# Altium schematic sheet OFFLINE_POWER_LNK30X.SchDoc
size A4; SheetNumber: 4; SheetTotal: 4
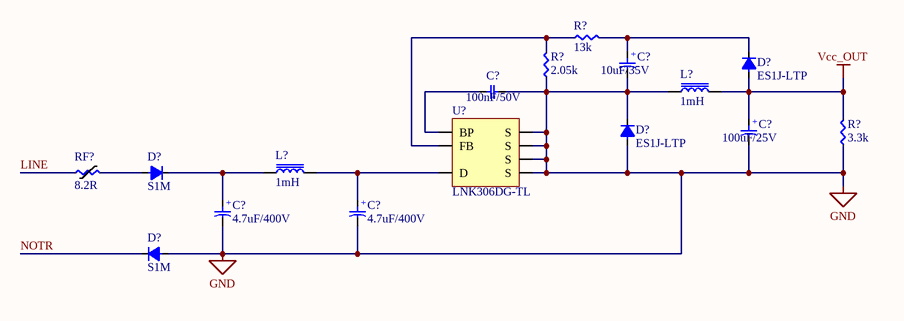
[diagram p0: OFFLINE_POWER_LNK30X.SchDoc]

## Parts
(Parts that share a designator on the sheet are numbered #1, #2 ... from top to bottom, then left to right.)
C?#1  10uF/35V  [Cap_Alu_1.5x4x8mm]
C?#2  100nF/50V  [Cap_0805]
C?#3  100uF/25V  [Cap_Alu_6.3x11x2.5mm]
C?#4  4.7uF/400V  [Cap_Alu_5x10x14.5mm]
C?#5  4.7uF/400V  [Cap_Alu_5x10x14.5mm]
D?#1  ES1J-LTP  [DO214AC(SMA)]
D?#2  ES1J-LTP  [DO214AC(SMA)]
D?#3  S1M  [DO214AC(SMA)]
D?#4  S1M  [DO214AC(SMA)]
L?#1  1mH  [INDUCTOR_7.8x7.0x5]
L?#2  1mH  [INDUCTOR_7.8x7.0x5]
R?#1  13k  [R_0805]
R?#2  2.05k  [R_0805]
R?#3  3.3k  [R_0805]
RF?  8.2R  [R_DIP_(6x12)_PIN_0.65]
U?  LNK306DG-TL  [SO8C-NOPIN3]

## Nets
GND: C?#1.2 C?#2.2 C?#3.2 C?#4.2 C?#5.2 D?#2.A(Anot) D?#2.K(Katot) D?#4.A(Anot) L?#1.1 R?#2.1 R?#3.1 U?.5(S) U?.6(S) U?.7(S) U?.8(S)
Vcc_OUT: C?#3.1 D?#1.A(Anot) L?#1.2 R?#3.2
LINE: RF?.1
NOTR: D?#4.K(Katot)
NetC?#1_1: C?#1.1 D?#1.K(Katot) R?#1.2
NetC?#2_1: C?#2.1 U?.1(BP)
NetC?#4_1: C?#4.1 D?#3.K(Katot) L?#2.1
NetC?#5_1: C?#5.1 L?#2.2 U?.4(D)
NetD?#3_A: D?#3.A(Anot) RF?.2
NetR?#1_1: R?#1.1 R?#2.2 U?.2(FB)

## Notes on the sheet
- (in symbol 400LLE4R7MEFC10X12.5) +
- (in symbol ECA-1EM101I) +
- (in symbol USR1V100MDD1TE) +

## Library data of the parts
C?#1 = USR1V100MDD1TE: CAP ALUM uF 10 35V 20% RADIAL; Manufacturer: Nichicon; Capacitance: 10uF; Polarity: Polar; Ripple Current: 31mA; Life (Hours): 2000Hour; Supplier 1: Digi-Key; Manufacturer Part Number: USR1V100MDD1TE; Stock 1: 4749; Pricing 1: 1 = 0,25000, 10 = 0,17200, 50 = 0,10300, 100 = 0,08700, 500 = 0,05954, 1000 = 0,05267 (USD); Mount: Through Hole; Case/Package: Radial; Min Operating Temperature: -40°C; Max Operating Temperature: 85°C; Package Quantity: 4000; Packaging: Tape and Reel; Voltage Rating: 35V; Tolerance: 20%; Lead Pitch: 0.059inch; Height - Seated (Max): 0.315inch; ComponentLink1URL: http://nichicon-us.com/english/products/pdfs/e-usa_usr.pdf?src-supplier=Digi-Key; ComponentLink1Description: http://nichicon-us.com/english/products/pdfs/e-usa_usr.pdf?src-supplier=Digi-Key; Supplier Part Number 1: 493-17431-1-ND
C?#2 = C2012X7R1H104K125AE: CAP CER nF 100 50V X7R 0805; Manufacturer: TDK Corporation; Tolerance: ±10%; Supplier 1: Digi-Key; Manufacturer Part Number: C2012X7R1H104K125AE; RoHS: RoHS Compliant; Category: Capacitors; Stock 1: 21863; Pricing 1: 1=0.29, 10=0.197, 100=0.1118, 500=0.07894, 1000=0.06907 (USD); Packaging: Cut Tape (CT); Part Status: Active; Voltage - Rated: 50V; Temperature Coefficient: X7R; Operating Temperature: -55°C ~ 125°C; Features: Soft Termination; Ratings: -; Applications: Boardflex Sensitive; Failure Rate: -; Mounting Type: Surface Mount, MLCC; Package / Case: 0805 (2012 Metric); Size / Dimension: 0.079" L x 0.049" W (2.00mm x 1.25mm); Height - Seated (Max): -; Thickness (Max): 0.057" (1.45mm); Lead Spacing: -; Lead Style: -; ComponentLink1URL: https://product.tdk.com/info/en/catalog/datasheets/mlcc_commercial_soft_en.pdf; ComponentLink1Description: https://product.tdk.com/info/en/catalog/datasheets/mlcc_commercial_soft_en.pdf; Supplier Part Number 1: 445-15929-1-ND
C?#3 = ECA-1EM101I: CAP ALUM uF 100 25V 20% RADIAL; Manufacturer 1: Panasonic; Description 1: Cap Aluminum Lytic 100uF 25V 20% (6.3 X 11.2mm) Radial 2.5mm 180mA 2000h 85C Ammo Pack; Capacitance: 100uF; Ripple Current: 180mA; Polarity: Polar; Life (Hours): 2000Hour; Leakage Current: 3mA; Dissipation Factor: 0.16%; Lead/Base Style: Straight; Lead Diameter: 0.5mm; Supplier 1: Digi-Key; Manufacturer Part Number 1: ECA-1EM101I; Stock 1: 18000; Pricing 1: 2000=0.0534, 4000=0.0494, 10000=0.04673, 14000=0.04432, 50000=0.04005, 100000=0.03631 (USD); Mount: Through Hole,PCB; Case/Package: Radial; Contact Plating: Tin; Min Operating Temperature: -40°C; Max Operating Temperature: 85°C; Tolerance: 20%; Voltage Rating (DC): 25V; Voltage Rating: 25V; Packaging: Tape and Reel; Package Quantity: 2000; Termination: Radial; Voltage: 25V; Diameter: 6.3mm; Length: 11.2mm; Height: 11.2mm; Lead Pitch: 2.5mm; Height - Seated (Max): 0.48inch; Radiation Hardening: No; REACH SVHC: Unknown; Lead Free: Lead Free; ComponentLink1URL: http://industrial.panasonic.com/www-data/pdf/ABA0000/ABA0000CE12.pdf?src-supplier=Avnet; ComponentLink1Description: http://industrial.panasonic.com/www-data/pdf/ABA0000/ABA0000CE12.pdf?src-supplier=Avnet; ComponentLink2URL: https://www.verical.com/server-webapp/html/getDatasheet?partID=239702&src-supplier=Verical; ComponentLink2Description: https://www.verical.com/server-webapp/html/getDatasheet?partID=239702&src-supplier=Verical; ComponentLink3URL: http://www.farnell.com/datasheets/1907780.pdf?src-supplier=Element14; ComponentLink3Description: http://www.farnell.com/datasheets/1907780.pdf?src-supplier=Element14; ComponentLink4URL: http://www.onlinecomponents.com/productFiles/mf-PSC/aba0000ce12.pdf?src-supplier=Onlinecomponents.com; ComponentLink4Description: http://www.onlinecomponents.com/productFiles/mf-PSC/aba0000ce12.pdf?src-supplier=Onlinecomponents.com; ComponentLink5URL: http://www.mouser.com/ds/2/315/ABA0000CE12-465472.pdf?src-supplier=Mouser; ComponentLink5Description: http://www.mouser.com/ds/2/315/ABA0000CE12-465472.pdf?src-supplier=Mouser; Supplier Part Number 1: P10413TB-ND
C?#4 C?#5 = 400LLE4R7MEFC10X12.5: CAP ALUM uF 4.7 400V 20% RADIAL; Manufacturer: Rubycon; Capacitance: 4.7uF; Ripple Current: 61mA; Life (Hours): 15000Hour; Supplier 1: Digi-Key; Manufacturer Part Number: 400LLE4R7MEFC10X12.5; Stock 1: 36795; Pricing 1: 1 = 0,59000, 10 = 0,41400, 50 = 0,31280, 100 = 0,27240, 500 = 0,20180, 1000 = 0,17153, 2500 = 0,16144, 5000 = 0,15135 (USD); RoHS: Yes; Mount: Through Hole; Case/Package: Radial; Min Operating Temperature: -40°C; Max Operating Temperature: 105°C; Tolerance: 20%; Package Quantity: 1000; Voltage Rating: 400V; Packaging: Bulk; Termination: Radial; Voltage Rating (DC): 400V; Diameter: 10mm; Height: 12.5mm; Lead Pitch: 0.197inch; Height - Seated (Max): 0.571inch; Radiation Hardening: No; ComponentLink1URL: https://datasheet.ciiva.com/6327/e-lle-6327238.pdf?src-supplier=Digi-Key; ComponentLink1Description: https://datasheet.ciiva.com/6327/e-lle-6327238.pdf?src-supplier=Digi-Key; Supplier Part Number 1: 1189-1334-ND
D?#1 D?#2 = ES1J-LTP: DIODE GEN PURP 600V 1A DO214AC; Manufacturer: MCC; Forward Voltage: 1.7V; Max Surge Current: 30A; Reverse Recovery Time: 35ns; Element Configuration: Single; Max Reverse Current: 80uA; Supplier 1: Digi-Key; Manufacturer Part Number: ES1J-LTP; RoHS: Yes; Category: Rectifier Diodes; Stock 1: 109029; Pricing 1: 1=0,45000, 10=0,33400, 100=0,18940, 500=0,12540, 1000=0,09614, 2000=0,08360 (USD); Mount: Surface Mount; Case/Package: SMA; Number of Pins: 2; Weight: 0.001199oz; Min Operating Temperature: -65°C; Max Operating Temperature: 175°C; Packaging: Tape and Reel; Package Quantity: 1; Reverse Voltage (DC): 600V; Average Rectified Current: 1A; Peak Non-Repetitive Surge Current: 30A; Forward Current: 1A; Recovery Time: 35ns; Max Reverse Voltage (DC): 600V; Series: -; Radiation Hardening: No; Lead Free: Lead Free; RoHS Compliant: Yes; ComponentLink1URL: https://datasheet.ciiva.com/917/es1a-les1j-ldo-214ac-917284.pdf?src-supplier=Digi-Key; ComponentLink1Description: https://datasheet.ciiva.com/917/es1a-les1j-ldo-214ac-917284.pdf?src-supplier=Digi-Key; ComponentLink2URL: https://datasheet.ciiva.com/917/es1a-les1j-ldo-214ac-917285.pdf?src-supplier=Digi-Key; ComponentLink2Description: https://datasheet.ciiva.com/917/es1a-les1j-ldo-214ac-917285.pdf?src-supplier=Digi-Key; ComponentLink3URL: https://datasheet.ciiva.com/917/es1a-les1j-ldo-214ac-917283.pdf?src-supplier=Digi-Key; ComponentLink3Description: https://datasheet.ciiva.com/917/es1a-les1j-ldo-214ac-917283.pdf?src-supplier=Digi-Key; Supplier Part Number 1: ES1J-LTPMSCT-ND
D?#3 D?#4 = S1M: DIODE GEN PURP 1KV 1A SMA; Manufacturer 1: ON Semiconductor / Fairchild; Forward Voltage: 1.1V; Element Configuration: Single; Reverse Recovery Time: 1.8us; Peak Non-Repetitive Surge Current: 30A; Polarity: Standard; Capacitance: 12pF; Peak Reverse Current: 1uA; Power Dissipation: 1.4W; Max Surge Current: 40A; Recovery Time: 1800ns; Supplier 1: Digi-Key; Manufacturer Part Number 1: S1M; Stock 1: 186500; Pricing 1: 1=0,24000, 10=0,19800, 25=0,16560, 100=0,08100, 250=0,07968, 500=0,06752, 1000=0,04692, 2500=0,04361 (USD); RoHS: Yes; Mount: Surface Mount; Case/Package: SMA; Number of Pins: 2; Contact Plating: Tin,Matte; Min Operating Temperature: -55°C; Max Operating Temperature: 150°C; Max Repetitive Reverse Voltage (Vrrm): 1kV; Max Forward Surge Current (Ifsm): 30A; Voltage Rating (DC): 1kV; Current Rating: 1A; Output Current: 1A; Packaging: Tape and Reel; Forward Current: 1A; Current: 1A; Voltage: 1kV; Max Reverse Voltage (DC): 1kV; Reverse Voltage: 1kV; Average Rectified Current: 1A; Package Quantity: 1; Termination: SMD/SMT; Length: 4.75mm; Height: 2.2mm; Width: 5.28mm; Radiation Hardening: No; REACH SVHC: No SVHC; Lead Free: Lead Free; ComponentLink1URL: https://datasheet.ciiva.com/27051/1072719-27051364.pdf?src-supplier=Jameco; ComponentLink1Description: https://datasheet.ciiva.com/27051/1072719-27051364.pdf?src-supplier=Jameco; ComponentLink2URL: https://datasheet.ciiva.com/4452/s1m-191340-4452980.pdf?src-supplier=Mouser; ComponentLink2Description: https://datasheet.ciiva.com/4452/s1m-191340-4452980.pdf?src-supplier=Mouser; ComponentLink3URL: https://datasheet.ciiva.com/910/s1a-910496.pdf?src-supplier=Digi-Key; ComponentLink3Description: https://datasheet.ciiva.com/910/s1a-910496.pdf?src-supplier=Digi-Key; ComponentLink4URL: https://datasheet.ciiva.com/8303/s1k-8303577.pdf?src-supplier=Avnet; ComponentLink4Description: https://datasheet.ciiva.com/8303/s1k-8303577.pdf?src-supplier=Avnet; ComponentLink5URL: https://datasheet.ciiva.com/7965/96437-7965306.pdf?src-supplier=Element14; ComponentLink5Description: https://datasheet.ciiva.com/7965/96437-7965306.pdf?src-supplier=Element14; ComponentLink6URL: https://datasheet.ciiva.com/5739/1766308-5739339.pdf?src-supplier=Farnell; ComponentLink6Description: https://datasheet.ciiva.com/5739/1766308-5739339.pdf?src-supplier=Farnell; ComponentLink7URL: https://datasheet.ciiva.com/7965/1766308-7965189.pdf?src-supplier=Element14; ComponentLink7Description: https://datasheet.ciiva.com/7965/1766308-7965189.pdf?src-supplier=Element14; ComponentLink8URL: https://datasheet.ciiva.com/22651/1766308-22651974.pdf?src-supplier=Element14; ComponentLink8Description: https://datasheet.ciiva.com/22651/1766308-22651974.pdf?src-supplier=Element14; ComponentLink9URL: https://datasheet.ciiva.com/7965/1766308-7965307.pdf?src-supplier=Element14; ComponentLink9Description: https://datasheet.ciiva.com/7965/1766308-7965307.pdf?src-supplier=Element14; Supplier Part Number 1: S1MFSCT-ND
L?#1 L?#2 = 76877530: FIXED IND mH 1 300MA 3.3 OHM SMD; Manufacturer: Wurth Electronics; Core Material: Ferrite; Tolerance: 10%; Shielding: Unshielded; DC Resistance (DCR): 3.3R; Self Resonant Frequency: 2.4MHz; Test Frequency: 100kHz; Supplier 1: Digi-Key; Manufacturer Part Number: 76877530; Stock 1: 1085; Pricing 1: 1 = 2,22000, 10 = 2,04600, 50 = 1,83500, 100 = 1,76400, 250 = 1,69300 (USD); RoHS: Yes; Mount: Surface Mount; Case/Package: 7850; Min Operating Temperature: -40°C; Max Operating Temperature: 125°C; Saturation Current: 300mA; Packaging: Cut Tape; Package Quantity: 500; Current Rating: 300mA; Inductance Tolerance: 10%; Resistor Type: Wirewound; Inductance: 1mH; Max DC Current: 300mA; Termination: SMD/SMT; RMS Current (Irms): 300mA; Length: 0.307inch; Width: 0.276inch; Height: 5mm; Height - Seated (Max): 0.217inch; REACH SVHC: Unknown; ComponentLink1URL: https://datasheet.ciiva.com/6690/76877530-6690354.pdf?src-supplier=Digi-Key; ComponentLink1Description: https://datasheet.ciiva.com/6690/76877530-6690354.pdf?src-supplier=Digi-Key; ComponentLink2URL: https://datasheet.ciiva.com/13320/76877530-64988-13320676.pdf?src-supplier=Mouser; ComponentLink2Description: https://datasheet.ciiva.com/13320/76877530-64988-13320676.pdf?src-supplier=Mouser; ComponentLink3URL: https://datasheet.ciiva.com/7892/1736809-7892998.pdf?src-supplier=Element14; ComponentLink3Description: https://datasheet.ciiva.com/7892/1736809-7892998.pdf?src-supplier=Element14; ComponentLink4URL: https://datasheet.ciiva.com/7265/1243443-7265530.pdf?src-supplier=Newark; ComponentLink4Description: https://datasheet.ciiva.com/7265/1243443-7265530.pdf?src-supplier=Newark; ComponentLink5URL: https://datasheet.ciiva.com/6690/76877530-6690358.pdf?src-supplier=Digi-Key; ComponentLink5Description: https://datasheet.ciiva.com/6690/76877530-6690358.pdf?src-supplier=Digi-Key; Supplier Part Number 1: 732-3272-6-ND
R?#1 = RC0805FR-0713KL: RES SMD 13K OHM 1% 1/8W 0805; Manufacturer: Yageo; Resistance: 13kR; Temperature Coefficient: 100ppm/°C; Voltage Rating (DC): 150V; Power Rating: 125mW; Supplier 1: Digi-Key; Manufacturer Part Number: RC0805FR-0713KL; Stock 1: 172528; Pricing 1: 1 = 0,10000, 10 = 0,03600, 100 = 0,01470, 1000 = 0,00660, 2500 = 0,00573 (USD); RoHS: Yes; Mount: Surface Mount; Case/Package: 0805; Case Code (Metric): 2012; Case Code (Imperial): 0805; Min Operating Temperature: -55°C; Max Operating Temperature: 155°C; Tolerance: 1%; Packaging: Tape and Reel; Resistor Type: Thick Film; Voltage Rating: 150V; Termination: SMD/SMT; Package Quantity: 1; Number of Terminations: 2; Max Power Dissipation: 125mW; Features: Moisture Resistant; Length: 2mm; Width: 0.049inch; Height: 0.5mm; Depth: 1.25mm; Lead Free: Lead Free; Military Standard: Not; ComponentLink1URL: https://datasheet.ciiva.com/11808/0900766b8106beab-11808595.pdf?src-supplier=RSComponents; ComponentLink1Description: https://datasheet.ciiva.com/11808/0900766b8106beab-11808595.pdf?src-supplier=RSComponents; ComponentLink2URL: https://datasheet.ciiva.com/2457/pyu-r-int-thick-7-2457158.pdf?src-supplier=Digi-Key; ComponentLink2Description: https://datasheet.ciiva.com/2457/pyu-r-int-thick-7-2457158.pdf?src-supplier=Digi-Key; ComponentLink3URL: https://datasheet.ciiva.com/2457/pyu-r-int-thick-7-2457159.pdf?src-supplier=Digi-Key; ComponentLink3Description: https://datasheet.ciiva.com/2457/pyu-r-int-thick-7-2457159.pdf?src-supplier=Digi-Key; ComponentLink4URL: https://datasheet.ciiva.com/2457/pyu-r-int-thick-7-2457160.pdf?src-supplier=Digi-Key; ComponentLink4Description: https://datasheet.ciiva.com/2457/pyu-r-int-thick-7-2457160.pdf?src-supplier=Digi-Key; ComponentLink5URL: https://datasheet.ciiva.com/16746/rc0805-16746411.pdf?src-supplier=Future+Electronics; ComponentLink5Description: https://datasheet.ciiva.com/16746/rc0805-16746411.pdf?src-supplier=Future+Electronics; ComponentLink6URL: https://datasheet.ciiva.com/15189/getdatasheetpartid-329342-15189900.pdf?src-supplier=Verical; ComponentLink6Description: https://datasheet.ciiva.com/15189/getdatasheetpartid-329342-15189900.pdf?src-supplier=Verical; Supplier Part Number 1: 311-13.0KCRDKR-ND
R?#2 = RC0805FR-072K05L: RES SMD 2.05K OHM 1% 1/8W 0805; Manufacturer: Yageo; Resistance: 2.05kR; Power Rating: 125mW; Voltage Rating: 150V; Temperature Coefficient: 100ppm/°C; Supplier 1: Avnet; Manufacturer Part Number: RC0805FR-072K05L; Stock 1: 0; Pricing 1: 5000 = 0,00230, 10000 = 0,00227, 20000 = 0,00220, 30000 = 0,00216, 40000 = 0,00207 (USD); RoHS: Yes; Case/Package: 0805; Case Code (Metric): 2012; Case Code (Imperial): 0805; Contact Plating: Tin,Matte,Lead; Min Operating Temperature: -55°C; Max Operating Temperature: 155°C; Package Quantity: 1; Tolerance: 1%; Packaging: Tape and Reel; Resistor Type: Thick Film; Number of Terminations: 2; Termination: SMD/SMT; Max Power Dissipation: 125mW; Voltage Rating (DC): 150V; Features: Moisture Resistant; Length: 2mm; Width: 0.049inch; Height: 0.024inch; Depth: 1.25mm; Radiation Hardening: No; Lead Free: Lead Free; Military Standard: Not; ComponentLink1URL: https://datasheet.ciiva.com/2457/pyu-r-int-thick-7-2457696.pdf?src-supplier=Digi-Key; ComponentLink1Description: https://datasheet.ciiva.com/2457/pyu-r-int-thick-7-2457696.pdf?src-supplier=Digi-Key; ComponentLink2URL: https://datasheet.ciiva.com/2457/pyu-r-int-thick-7-2457697.pdf?src-supplier=Digi-Key; ComponentLink2Description: https://datasheet.ciiva.com/2457/pyu-r-int-thick-7-2457697.pdf?src-supplier=Digi-Key; ComponentLink3URL: https://datasheet.ciiva.com/16747/rc0805-16747269.pdf?src-supplier=Future+Electronics; ComponentLink3Description: https://datasheet.ciiva.com/16747/rc0805-16747269.pdf?src-supplier=Future+Electronics; ComponentLink4URL: https://datasheet.ciiva.com/12558/rc0805-257173-12558759.pdf?src-supplier=Mouser; ComponentLink4Description: https://datasheet.ciiva.com/12558/rc0805-257173-12558759.pdf?src-supplier=Mouser; ComponentLink5URL: https://datasheet.ciiva.com/2457/pyu-r-int-thick-7-2457695.pdf?src-supplier=Digi-Key; ComponentLink5Description: https://datasheet.ciiva.com/2457/pyu-r-int-thick-7-2457695.pdf?src-supplier=Digi-Key; Supplier Part Number 1: RC0805FR-072K05L
R?#3 = RC0805JR-073K3L: RES SMD 3.3K OHM 5% 1/8W 0805; Manufacturer: Yageo; Resistance: 3.3kR; Power Rating: 125mW; Voltage Rating: 150V; Temperature Coefficient: 100ppm/°C; Supplier 1: Digi-Key; Manufacturer Part Number: RC0805JR-073K3L; Stock 1: 223645; Pricing 1: 1 = 0,10000, 10 = 0,03100, 100 = 0,01260, 1000 = 0,00567, 2500 = 0,00492 (USD); RoHS: Yes; Case/Package: 0805; Case Code (Imperial): 0805; Case Code (Metric): 2012; Contact Plating: Tin,Matte,Lead; Min Operating Temperature: -55°C; Max Operating Temperature: 155°C; Tolerance: 5%; Packaging: Tape and Reel; Termination: SMD/SMT; Resistor Type: Thick Film; Length: 2mm; Depth: 1.25mm; Radiation Hardening: No; REACH SVHC: Unknown; Military Standard: Not; Lead Free: Lead Free; ComponentLink1URL: https://datasheet.ciiva.com/12667/rc0805-12667382.pdf?src-supplier=Mouser; ComponentLink1Description: https://datasheet.ciiva.com/12667/rc0805-12667382.pdf?src-supplier=Mouser; ComponentLink2URL: https://datasheet.ciiva.com/7941/442941-7941959.pdf?src-supplier=Element14; ComponentLink2Description: https://datasheet.ciiva.com/7941/442941-7941959.pdf?src-supplier=Element14; ComponentLink3URL: https://datasheet.ciiva.com/7941/442941-7941960.pdf?src-supplier=Element14; ComponentLink3Description: https://datasheet.ciiva.com/7941/442941-7941960.pdf?src-supplier=Element14; ComponentLink4URL: https://datasheet.ciiva.com/16944/rc0805-16944442.pdf?src-supplier=Future+Electronics; ComponentLink4Description: https://datasheet.ciiva.com/16944/rc0805-16944442.pdf?src-supplier=Future+Electronics; ComponentLink5URL: https://datasheet.ciiva.com/46395/444164-46395133.pdf?src-supplier=Element14; ComponentLink5Description: https://datasheet.ciiva.com/46395/444164-46395133.pdf?src-supplier=Element14; Supplier Part Number 1: 311-3.3KARCT-ND
RF? = FW20A8R20JA: RES FUSIBLE 8.2 OHM 2W 5% AXIAL; Manufacturer: Bourns; Temperature Coefficient: 200ppm/°C; Supplier 1: Digi-Key; Manufacturer Part Number: FW20A8R20JA; Stock 1: 374; Pricing 1: 1 = 0,64000, 10 = 0,46000, 25 = 0,35880, 50 = 0,30360, 100 = 0,23920, 250 = 0,20240, 500 = 0,16560 (USD); RoHS: Yes; Case/Package: Axial; Min Operating Temperature: -55°C; Max Operating Temperature: 155°C; Package Quantity: 1000; Packaging: Tape and Reel; Resistance: 8.2R; Tolerance: 5%; Power Rating: 2W; Resistor Type: Wirewound; Number of Terminations: 2; Termination: Axial; Max Power Dissipation: 2W; Length: 0.472inch; ComponentLink1URL: https://datasheet.ciiva.com/12835/fw-12835070.pdf?src-supplier=Mouser; ComponentLink1Description: https://datasheet.ciiva.com/12835/fw-12835070.pdf?src-supplier=Mouser; Supplier Part Number 1: 118-FW20A8R20JACT-ND
U? = LNK306DG-TL: IC REG SMPS pOFFLINE SWIT OCP 8SOP; Manufacturer: Power Integrations; Output Voltage: 12V; Output Current: 225mA; Breakdown Voltage: 700V; Max Supply Voltage (AC): 265V; Min Supply Voltage (AC): 85V; Nominal Supply Current: 68uA; Max Power Dissipation: 12mW; Max Duty Cycle: 72%; Number of Outputs: 1; Supplier 1: Digi-Key; Manufacturer Part Number: LNK306DG-TL; Stock 1: 6575; Pricing 1: 1 = 1,68000, 10 = 1,51100, 25 = 1,42520, 100 = 1,14000, 250 = 0,99752, 500 = 0,96900, 1000 = 0,76950 (USD); RoHS: Yes; Mount: Surface Mount; Case/Package: SOIC; Number of Pins: 7; Min Operating Temperature: -40°C; Max Operating Temperature: 150°C; Package Quantity: 1; Packaging: Tape and Reel; Radiation Hardening: No; ComponentLink1URL: https://datasheet.ciiva.com/1929/lnk302-304-306-1929833.pdf?src-supplier=Digi-Key; ComponentLink1Description: https://datasheet.ciiva.com/1929/lnk302-304-306-1929833.pdf?src-supplier=Digi-Key; ComponentLink2URL: https://datasheet.ciiva.com/1929/lnk302-304-306-1929834.pdf?src-supplier=Digi-Key; ComponentLink2Description: https://datasheet.ciiva.com/1929/lnk302-304-306-1929834.pdf?src-supplier=Digi-Key; ComponentLink3URL: https://datasheet.ciiva.com/1929/lnk302-304-306-1929835.pdf?src-supplier=Digi-Key; ComponentLink3Description: https://datasheet.ciiva.com/1929/lnk302-304-306-1929835.pdf?src-supplier=Digi-Key; ComponentLink4URL: https://datasheet.ciiva.com/3229/lnk302-304-306-3229964.pdf?src-supplier=Avnet; ComponentLink4Description: https://datasheet.ciiva.com/3229/lnk302-304-306-3229964.pdf?src-supplier=Avnet; ComponentLink5URL: https://datasheet.ciiva.com/12238/lnk302-304-306-179954-12238844.pdf?src-supplier=Mouser; ComponentLink5Description: https://datasheet.ciiva.com/12238/lnk302-304-306-179954-12238844.pdf?src-supplier=Mouser; ComponentLink6URL: https://datasheet.ciiva.com/16470/lnk302-304-306-16470990.pdf?src-supplier=Avnet+Asia; ComponentLink6Description: https://datasheet.ciiva.com/16470/lnk302-304-306-16470990.pdf?src-supplier=Avnet+Asia; Supplier Part Number 1: 596-1239-1-ND